# Altium schematic sheet pulse_gen.SchDoc: Pulse Generation
size A; Engineer: A. Peck; Organization: UCLA High Energy Physics; DocumentNumber: 11; Revision: 3.0; SheetNumber: 11; SheetTotal: 15; Project: LCT Comparator Tester
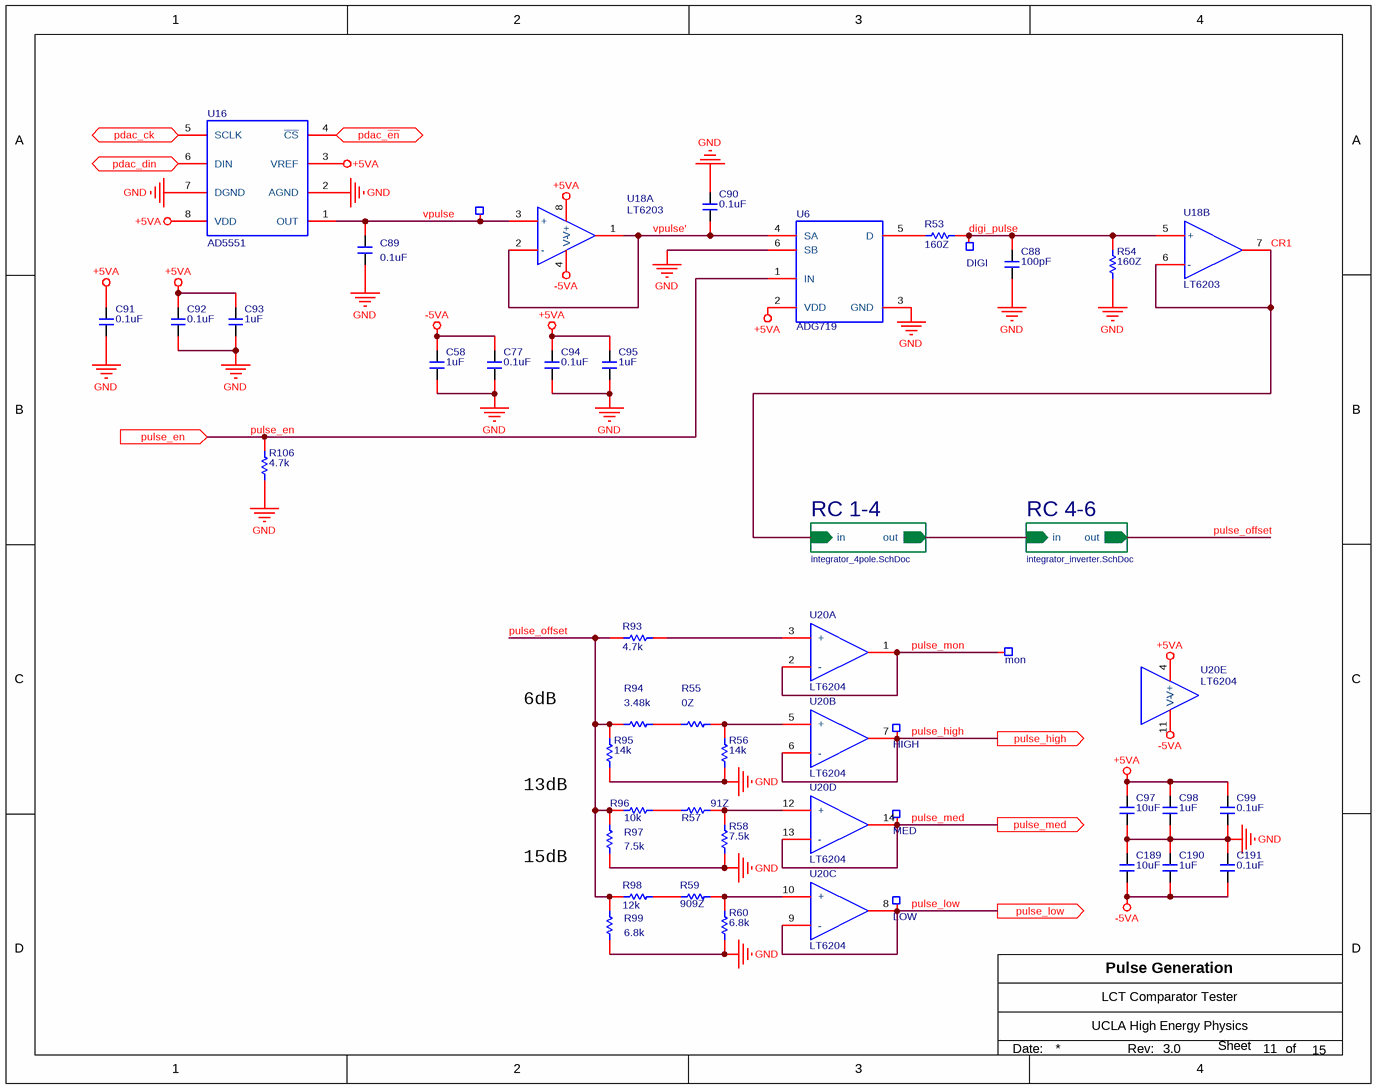
[diagram p0: pulse_gen.SchDoc]

## Parts
C58  1uF  [C0603]
C77  0.1uF  [C0603]
C88  100pF  [C0603]
C89  0.1uF  [C0603]
C90  0.1uF  [C0603]
C91  0.1uF  [C0603]
C92  0.1uF  [C0603]
C93  1uF  [C0603]
C94  0.1uF  [C0603]
C95  1uF  [C0603]
C97  10uF  [c1206]
C98  1uF  [C0603]
C99  0.1uF  [C0603]
C189  10uF  [c1206]
C190  1uF  [C0603]
C191  0.1uF  [C0603]
mon  TP_SMALL  [TP_SMALL]  (value not drawn)  (no BOM)
R53  160Z  [R0603]
R54  160Z  [R0603]
R55  0Z  [R0805]
R56  14k  [R0805]
R57  91Z  [R0805]
R58  7.5k  [R0805]
R59  909Z  [R0805]
R60  6.8k  [R0805]
R93  4.7k  [R0805]
R94  3.48k  [R0805]
R95  14k  [R0805]
R96  10k  [R0805]
R97  7.5k  [R0805]
R98  12k  [R0805]
R99  6.8k  [R0805]
R106  4.7k  [R0603]
TP27  PDAC  [TP_MICRO]  (value not drawn)  (no BOM)
TP28  DIGI  [TP_MICRO]  (no BOM)
TP29  HIGH  [TP_MICRO]  (no BOM)
TP30  MED  [TP_MICRO]  (no BOM)
TP31  LOW  [TP_MICRO]  (no BOM)
U6  ADG719  [SOT23-6]
U16  AD5551  [SOIC-8]
U18  LT6203  [SOIC-8]  (parts A,B of 2)
U20  LT6204  [SOIC-14]  (parts A,B,C,D,E of 5)

## Sub-sheets
RC 1-4 = integrator_4pole.SchDoc: out (out), in (in)
RC 4-6 = integrator_inverter.SchDoc: out (out), in (in)

## Ports
pdac_ck (in), pdac_din (in), pdac_~{en} (in), pulse_en (in), pulse_high (out), pulse_low (out), pulse_med (out)

## Nets
+5VA: C91.2 C92.2 C93.2 C94.2 C95.2 C97.1 C98.2 C99.2 U6.2(VDD) U16.3(VREF) U16.8(VDD) U18.8(V+) U20.4(V+)
-5VA: C58.2 C77.2 C189.2 C190.1 C191.1 U18.4(V-) U20.11(V-)
GND: C58.1 C77.1 C88.1 C89.1 C90.1 C91.1 C92.1 C93.1 C94.1 C95.1 C97.2 C98.1 C99.1 C189.1 C190.2 C191.2 R54.1 R56.1 R58.1 R60.1 R95.1 R97.1 R99.1 R106.1 U6.3(GND) U6.6(SB) U16.2(AGND) U16.7(DGND)
CR1: U18.6(-) U18.7(OUTB) ; sheet RC 1-4/in
digi_pulse: C88.2 R53.2 R54.2 TP28.1 U18.5(+)
pdac_ck: U16.5(SCLK) ; port pdac_ck
pdac_din: U16.6(DIN) ; port pdac_din
pdac_~{en}: U16.4(~{CS}) ; port pdac_~{en}
pulse_en: R106.2 U6.1(IN) ; port pulse_en
pulse_high: TP29.1 U20.6(-) U20.7(OUT) ; port pulse_high
pulse_low: TP31.1 U20.8(OUT) U20.9(-) ; port pulse_low
pulse_med: TP30.1 U20.13(-) U20.14(OUT) ; port pulse_med
pulse_mon: mon.1 U20.1(OUT) U20.2(-)
pulse_offset: R93.1 R94.1 R95.2 R96.1 R97.2 R98.1 R99.2 ; sheet RC 4-6/out
vpulse: C89.2 TP27.1 U16.1(OUT) U18.3(+)
vpulse': C90.2 U6.4(SA) U18.1(OUTA) U18.2(-)
NetR53_1: R53.1 U6.5(NC)
NetR55_1: R55.1 R94.2
NetR55_2: R55.2 R56.2 U20.5(+)
NetR57_1: R57.1 R96.2
NetR57_2: R57.2 R58.2 U20.12(+)
NetR59_1: R59.1 R60.2 U20.10(+)
NetR59_2: R59.2 R98.2
NetR93_2: R93.2 U20.3(+)
(unnamed): sheet RC 1-4/out, sheet RC 4-6/in

## Notes on the sheet
- 6dB
- 13dB
- 15dB
- Date:
- Rev:
- of
- Sheet

## Library data of the parts
C58 C93 C95 C98 C190 = Murata/GRM188R61E105KA12D: CAP-CER, 2, 1.0uF, 10%, 25V, 0603; Manufacturer: Murata Electronics North America; Capacitance: 1µF; Temperature Coefficient: X5R; Supplier 1: Digi-Key; Supplier Part Number 1: 490-3897-1-ND; Manufacturer Part Number: GRM188R61E105KA12D; RoHS: RoHS Compliant; Category: Capacitors; Stock 1: 1899119; Pricing 1: 1=0.1, 10=0.036, 50=0.0196, 100=0.0165, 250=0.01352, 500=0.01156, 1000=0.009 (USD); Packaging: Cut Tape (CT); Tolerance: ±10%; Voltage - Rated: 25V; Mounting Type: Surface Mount, MLCC; Operating Temperature: -55°C ~ 85°C; Applications: General Purpose; Ratings: -; Package / Case: 0603 (1608 Metric); Size / Dimension: 0.063" L x 0.031" W (1.60mm x 0.80mm); Height - Seated (Max): -; Thickness (Max): 0.035" (0.90mm); Lead Spacing: -; Features: -; Lead Style: -; ComponentLink1URL: http://www.murata.com/~/media/webrenewal/support/library/catalog/products/capacitor/mlcc/c02e.pdf; ComponentLink1Description: http://www.murata.com/~/media/webrenewal/support/library/catalog/products/capacitor/mlcc/c02e.pdf
C77 C89-C92 C94 C99 C191 = CAP/06035C104KAT2A: CAP-CER, 2, 0.1uF, 10%, 50V, 0603, X7R; Manufacturer: AVX Corporation; Capacitance: 0.10µF; Supplier 1: Digi-Key; Manufacturer Part Number: 06035C104KAT2A; RoHS: RoHS Compliant; Category: Capacitors; Stock 1: 4412408; Pricing 1: 1=0.1, 10=0.036, 25=0.0264, 50=0.0198, 100=0.0162, 250=0.01352, 500=0.01156, 1000=0.00908 (USD); Packaging: Cut Tape (CT); Tolerance: ±10%; Voltage - Rated: 50V; Temperature Coefficient: X7R; Mounting Type: Surface Mount, MLCC; Operating Temperature: -55°C ~ 125°C; Applications: General Purpose; Ratings: -; Package / Case: 0603 (1608 Metric); Size / Dimension: 0.063" L x 0.032" W (1.60mm x 0.81mm); Height - Seated (Max): -; Thickness (Max): 0.035" (0.90mm); Lead Spacing: -; Features: -; Lead Style: -; ComponentLink1URL: http://datasheets.avx.com/X7RDielectric.pdf; ComponentLink1Description: http://datasheets.avx.com/X7RDielectric.pdf; Supplier Part Number 1: 478-5052-1-ND; Supplier 2: Newark; Supplier Part Number 2: 54K2412
C88 = AVX/06035A101KAT2A: CAP-CER, 0, 100pF, 10%, 50V, 0603; Manufacturer: AVX Corporation; Temperature Coefficient: C0G, NP0; Supplier 1: Digi-Key; Supplier Part Number 1: 478-3717-1-ND; Manufacturer Part Number: 06035A101KAT2A; RoHS: RoHS Compliant; Category: Capacitors; Stock 1: 55355; Pricing 1: 1=0.16, 10=0.117, 25=0.0856, 50=0.0664, 100=0.0551, 250=0.04556, 500=0.03862, 1000=0.03197 (USD); Packaging: Cut Tape (CT); Part Status: Active; Capacitance: 100pF; Tolerance: ±10%; Voltage - Rated: 50V; Operating Temperature: -55°C ~ 125°C; Features: -; Ratings: -; Applications: General Purpose; Failure Rate: *; Mounting Type: Surface Mount, MLCC; Package / Case: 0603 (1608 Metric); Size / Dimension: 0.063" L x 0.032" W (1.60mm x 0.81mm); Height - Seated (Max): -; Thickness (Max): 0.035" (0.90mm); Lead Spacing: -; Lead Style: -; ComponentLink1URL: http://catalogs.avx.com/SurfaceMount.pdf; ComponentLink1Description: http://catalogs.avx.com/SurfaceMount.pdf
C97 C189 = CAP/GMK316F106ZL-T: CAP-CER, 2, 10uF, 10%, 35V, 1206; Manufacturer: Taiyo Yuden; Capacitance: 10µF; Tolerance: -20%, +80%; Temperature Coefficient: Y5V (F); Supplier 1: Digi-Key; Manufacturer Part Number: GMK316F106ZL-T; RoHS: RoHS Compliant; Category: Capacitors; Packaging: Cut Tape (CT); Voltage - Rated: 35V; Mounting Type: Surface Mount, MLCC; Operating Temperature: -30°C ~ 85°C; Package / Case: 1206 (3216 Metric); Size / Dimension: 0.126" L x 0.063" W (3.20mm x 1.60mm); Height - Seated (Max): -; Lead Spacing: -; Features: -; ComponentLink1URL: http://ds.yuden.co.jp/TYCOMPAS/ut/detail.do?productNo=GMK316F106ZL-T&fileName=GMK316F106ZL-T_SS&mode=specSheetDownload; ComponentLink1Description: http://ds.yuden.co.jp/TYCOMPAS/ut/detail.do?productNo=GMK316F106ZL-T&fileName=GMK316F106ZL-T_SS&mode=specSheetDownload; Supplier Part Number 1: 587-1352-1-ND; Stock 1: 249989; Pricing 1: 1=0.46, 10=0.345, 50=0.2012, 100=0.161, 250=0.115, 500=0.0782, 1000=0.06325 (USD); Applications: General Purpose; Ratings: -; Thickness (Max): 0.071" (1.80mm); Lead Style: -
mon = TP_SMALL: Test Point, Generic, 50MIL
R53 R54 = CRCW0603160RFKEA: RES0, SMD,  160Z, 1.0%, 1/10W, 0603; Manufacturer: Vishay Dale; Resistance (Ohms): 160; Tolerance: ±1%; Power (Watts): 0.1W, 1/10W; Temperature Coefficient: ±100ppm/°C; Supplier 1: Digi-Key; Manufacturer Part Number: CRCW0603160RFKEA; RoHS: RoHS Compliant; Category: Resistors; Stock 1: 48671; Pricing 1: 1=0.1, 10=0.03, 25=0.022, 50=0.0168, 100=0.0123, 250=0.0094, 500=0.00752, 1000=0.00554, 2500=0.00481 (USD); Packaging: Cut Tape (CT); Part Status: Active; Composition: Thick Film; Features: Automotive AEC-Q200; Operating Temperature: -55°C ~ 155°C; Package / Case: 0603 (1608 Metric); Supplier Device Package: 0603; Size / Dimension: 0.063" L x 0.033" W (1.60mm x 0.85mm); Height - Seated (Max): 0.020" (0.50mm); Number of Terminations: 2; Failure Rate: -; ComponentLink1URL: http://www.vishay.com/docs/20035/dcrcwe3.pdf; ComponentLink1Description: http://www.vishay.com/docs/20035/dcrcwe3.pdf; Supplier Part Number 1: 541-160HCT-ND
R55 = CRCW08050000Z0EA: RES0, SMD, 0.00Z, 0805; Manufacturer: Vishay Dale; Resistance (Ohms): 0.0; Tolerance: Jumper; Power (Watts): 0.125W, 1/8W; Supplier 1: Digi-Key; Manufacturer Part Number: CRCW08050000Z0EA; RoHS: RoHS Compliant; Category: Resistors; Stock 1: 1159983; Pricing 1: 1=0.1, 10=0.026, 25=0.0184, 50=0.014, 100=0.0104, 250=0.00792, 500=0.00634, 1000=0.00466, 2500=0.00405 (USD); Packaging: Cut Tape (CT); Part Status: Active; Composition: Thick Film; Features: Automotive AEC-Q200; Temperature Coefficient: -; Operating Temperature: -55°C ~ 155°C; Package / Case: 0805 (2012 Metric); Supplier Device Package: 0805; Size / Dimension: 0.079" L x 0.049" W (2.00mm x 1.25mm); Height - Seated (Max): 0.020" (0.50mm); Number of Terminations: 2; Failure Rate: -; ComponentLink1URL: http://www.vishay.com/docs/20035/dcrcwe3.pdf; ComponentLink1Description: http://www.vishay.com/docs/20035/dcrcwe3.pdf; Supplier Part Number 1: 541-0.0ACT-ND
R56 R95 = RC0805FR-0714KL: RES1, SMD, 14.0k, 1.0%, 1/8W, 0805; Manufacturer: Yageo; Tolerance: ±1%; Power (Watts): 0.125W, 1/8W; Temperature Coefficient: ±100ppm/°C; Supplier 1: Digi-Key; Manufacturer Part Number: RC0805FR-0714KL; RoHS: RoHS Compliant; Category: Resistors; Stock 1: 169694; Pricing 1: 1=0.1, 10=0.021, 25=0.0152, 100=0.0084, 250=0.00644, 500=0.00514, 1000=0.00379, 2500=0.00329 (USD); Packaging: Cut Tape (CT); Part Status: Active; Resistance (Ohms): 14k; Composition: Thick Film; Features: Moisture Resistant; Operating Temperature: -55°C ~ 155°C; Package / Case: 0805 (2012 Metric); Supplier Device Package: 0805; Size / Dimension: 0.079" L x 0.049" W (2.00mm x 1.25mm); Height - Seated (Max): 0.024" (0.60mm); Number of Terminations: 2; Failure Rate: -; ComponentLink1URL: http://www.yageo.com/NewPortal/yageodocoutput?fileName=/pdf/R-Chip/PYu-RC_Group_51_RoHS_L_4.pdf; ComponentLink1Description: http://www.yageo.com/NewPortal/yageodocoutput?fileName=/pdf/R-Chip/PYu-RC_Group_51_RoHS_L_4.pdf; Supplier Part Number 1: 311-14.0KCRCT-ND
R57 = ERJ-6ENF91R0V: RES0, SMD, 91Z, 1.0%, 1/8W, 0805; Manufacturer: Panasonic Electronic Components; Resistance (Ohms): 91; Tolerance: ±1%; Power (Watts): 0.125W, 1/8W; Temperature Coefficient: ±100ppm/°C; Supplier 1: Digi-Key; Manufacturer Part Number: ERJ-6ENF91R0V; RoHS: RoHS Compliant; Category: Resistors; Stock 1: 64099; Pricing 1: 1=0.1, 50=0.022, 100=0.0162, 250=0.01236, 500=0.0099, 1000=0.00729 (USD); Packaging: Cut Tape (CT); Part Status: Active; Composition: Thick Film; Features: Automotive AEC-Q200; Operating Temperature: -55°C ~ 155°C; Package / Case: 0805 (2012 Metric); Supplier Device Package: 0805; Size / Dimension: 0.079" L x 0.049" W (2.00mm x 1.25mm); Height - Seated (Max): 0.028" (0.70mm); Number of Terminations: 2; Failure Rate: -; ComponentLink1URL: http://industrial.panasonic.com/www-cgi/jvcr13pz.cgi?E+PZ+3+AOA0002+ERJ6ENF91R0V+7+WW; ComponentLink1Description: http://industrial.panasonic.com/www-cgi/jvcr13pz.cgi?E+PZ+3+AOA0002+ERJ6ENF91R0V+7+WW; Supplier Part Number 1: P91.0CCT-ND
R58 R97 = RC0805FR-077K5L: RES1, SMD, 7.5k, 1.0%, 1/8W, 0805; Manufacturer: Yageo; Tolerance: ±1%; Power (Watts): 0.125W, 1/8W; Temperature Coefficient: ±100ppm/°C; Supplier 1: Digi-Key; Manufacturer Part Number: RC0805FR-077K5L; RoHS: RoHS Compliant; Category: Resistors; Stock 1: 186916; Pricing 1: 1=0.1, 10=0.021, 25=0.0152, 100=0.0084, 250=0.00644, 500=0.00514, 1000=0.00379, 2500=0.00329 (USD); Packaging: Cut Tape (CT); Part Status: Active; Resistance (Ohms): 7.5k; Composition: Thick Film; Features: Moisture Resistant; Operating Temperature: -55°C ~ 155°C; Package / Case: 0805 (2012 Metric); Supplier Device Package: 0805; Size / Dimension: 0.079" L x 0.049" W (2.00mm x 1.25mm); Height - Seated (Max): 0.024" (0.60mm); Number of Terminations: 2; Failure Rate: -; ComponentLink1URL: http://www.yageo.com/NewPortal/yageodocoutput?fileName=/pdf/R-Chip/PYu-RC_Group_51_RoHS_L_4.pdf; ComponentLink1Description: http://www.yageo.com/NewPortal/yageodocoutput?fileName=/pdf/R-Chip/PYu-RC_Group_51_RoHS_L_4.pdf; Supplier Part Number 1: 311-7.50KCRCT-ND
R59 = RC0805FR-07909RL: RES0, SMD, 6.8k, 1.0%, 1/8W, 0805; Manufacturer: Yageo; Resistance (Ohms): 909; Tolerance: ±1%; Power (Watts): 0.125W, 1/8W; Temperature Coefficient: ±100ppm/°C; Supplier 1: Digi-Key; Manufacturer Part Number: RC0805FR-07909RL; RoHS: RoHS Compliant; Category: Resistors; Stock 1: 53236; Pricing 1: 1=0.1, 10=0.021, 25=0.0152, 100=0.0084, 250=0.00644, 500=0.00514, 1000=0.00379, 2500=0.00329 (USD); Packaging: Cut Tape (CT); Part Status: Active; Composition: Thick Film; Features: Moisture Resistant; Operating Temperature: -55°C ~ 155°C; Package / Case: 0805 (2012 Metric); Supplier Device Package: 0805; Size / Dimension: 0.079" L x 0.049" W (2.00mm x 1.25mm); Height - Seated (Max): 0.024" (0.60mm); Number of Terminations: 2; Failure Rate: -; ComponentLink1URL: http://www.yageo.com/NewPortal/yageodocoutput?fileName=/pdf/R-Chip/PYu-RC_Group_51_RoHS_L_4.pdf; ComponentLink1Description: http://www.yageo.com/NewPortal/yageodocoutput?fileName=/pdf/R-Chip/PYu-RC_Group_51_RoHS_L_4.pdf; Supplier Part Number 1: 311-909CRCT-ND
R60 R99 = RC0805FR-076K8L: RES1, SMD, 6.8k, 1.0%, 1/8W, 0805; Manufacturer: Yageo; Tolerance: ±1%; Power (Watts): 0.125W, 1/8W; Temperature Coefficient: ±100ppm/°C; Supplier 1: Digi-Key; Manufacturer Part Number: RC0805FR-076K8L; RoHS: RoHS Compliant; Category: Resistors; Stock 1: 249753; Pricing 1: 1=0.1, 10=0.021, 25=0.0152, 100=0.0084, 250=0.00644, 500=0.00514, 1000=0.00379, 2500=0.00329 (USD); Packaging: Cut Tape (CT); Part Status: Active; Resistance (Ohms): 6.8k; Composition: Thick Film; Features: Moisture Resistant; Operating Temperature: -55°C ~ 155°C; Package / Case: 0805 (2012 Metric); Supplier Device Package: 0805; Size / Dimension: 0.079" L x 0.049" W (2.00mm x 1.25mm); Height - Seated (Max): 0.024" (0.60mm); Number of Terminations: 2; Failure Rate: -; ComponentLink1URL: http://www.yageo.com/NewPortal/yageodocoutput?fileName=/pdf/R-Chip/PYu-RC_Group_51_RoHS_L_4.pdf; ComponentLink1Description: http://www.yageo.com/NewPortal/yageodocoutput?fileName=/pdf/R-Chip/PYu-RC_Group_51_RoHS_L_4.pdf; Supplier Part Number 1: 311-6.80KCRCT-ND
R93 = CRCW08054K70FKEA: RES1, SMD, 4.70k, 1.0%, 1/10W, 0805; Manufacturer: Vishay Dale; Tolerance: ±1%; Power (Watts): 0.125W, 1/8W; Temperature Coefficient: ±100ppm/°C; Supplier 1: Digi-Key; Manufacturer Part Number: CRCW08054K70FKEA; RoHS: RoHS Compliant; Category: Resistors; Stock 1: 53264; Pricing 1: 1=0.1, 10=0.04, 25=0.0288, 50=0.022, 100=0.0162, 250=0.01236, 500=0.0099, 1000=0.00729, 2500=0.00632 (USD); Packaging: Cut Tape (CT); Part Status: Active; Resistance (Ohms): 4.7k; Composition: Thick Film; Features: Automotive AEC-Q200; Operating Temperature: -55°C ~ 155°C; Package / Case: 0805 (2012 Metric); Supplier Device Package: 0805; Size / Dimension: 0.079" L x 0.049" W (2.00mm x 1.25mm); Height - Seated (Max): 0.020" (0.50mm); Number of Terminations: 2; Failure Rate: -; ComponentLink1URL: http://www.vishay.com/docs/20035/dcrcwe3.pdf; ComponentLink1Description: http://www.vishay.com/docs/20035/dcrcwe3.pdf; Supplier Part Number 1: 541-4.70KCCT-ND
R94 = RC0805FR-073K48L: RES1, SMD, 3.48k, 1.0%, 1/10W, 0805; Manufacturer: Yageo; Tolerance: ±1%; Power (Watts): 0.125W, 1/8W; Temperature Coefficient: ±100ppm/°C; Supplier 1: Digi-Key; Manufacturer Part Number: RC0805FR-073K48L; RoHS: RoHS Compliant; Category: Resistors; Stock 1: 122027; Pricing 1: 1=0.1, 10=0.021, 25=0.0152, 100=0.0084, 250=0.00644, 500=0.00514, 1000=0.00379, 2500=0.00329 (USD); Packaging: Cut Tape (CT); Part Status: Active; Resistance (Ohms): 3.48k; Composition: Thick Film; Features: Moisture Resistant; Operating Temperature: -55°C ~ 155°C; Package / Case: 0805 (2012 Metric); Supplier Device Package: 0805; Size / Dimension: 0.079" L x 0.049" W (2.00mm x 1.25mm); Height - Seated (Max): 0.024" (0.60mm); Number of Terminations: 2; Failure Rate: -; ComponentLink1URL: http://www.yageo.com/NewPortal/yageodocoutput?fileName=/pdf/R-Chip/PYu-RC_Group_51_RoHS_L_4.pdf; ComponentLink1Description: http://www.yageo.com/NewPortal/yageodocoutput?fileName=/pdf/R-Chip/PYu-RC_Group_51_RoHS_L_4.pdf; Supplier Part Number 1: 311-3.48KCRCT-ND
R96 = RC0805FR-0710KL: RES1, SMD, 10.0k, 1.0%, 1/8W, 0805; Manufacturer: Yageo; Tolerance: ±1%; Power (Watts): 0.125W, 1/8W; Temperature Coefficient: ±100ppm/°C; Supplier 1: Digi-Key; Manufacturer Part Number: RC0805FR-0710KL; RoHS: RoHS Compliant; Category: Resistors; Stock 1: 9171495; Pricing 1: 1=0.1, 10=0.021, 25=0.0152, 100=0.0084, 250=0.00644, 500=0.00514, 1000=0.00379, 2500=0.00329 (USD); Packaging: Cut Tape (CT); Part Status: Active; Resistance (Ohms): 10k; Composition: Thick Film; Features: Moisture Resistant; Operating Temperature: -55°C ~ 155°C; Package / Case: 0805 (2012 Metric); Supplier Device Package: 0805; Size / Dimension: 0.079" L x 0.049" W (2.00mm x 1.25mm); Height - Seated (Max): 0.024" (0.60mm); Number of Terminations: 2; Failure Rate: -; ComponentLink1URL: http://www.yageo.com/NewPortal/yageodocoutput?fileName=/pdf/R-Chip/PYu-RC_Group_51_RoHS_L_4.pdf; ComponentLink1Description: http://www.yageo.com/NewPortal/yageodocoutput?fileName=/pdf/R-Chip/PYu-RC_Group_51_RoHS_L_4.pdf; Supplier Part Number 1: 311-10.0KCRCT-ND
R98 = RC0805FR-0712KL: RES1, SMD, 12.0k, 1.0%, 1/8W, 0805; Manufacturer: Yageo; Tolerance: ±1%; Power (Watts): 0.125W, 1/8W; Temperature Coefficient: ±100ppm/°C; Supplier 1: Digi-Key; Manufacturer Part Number: RC0805FR-0712KL; RoHS: RoHS Compliant; Category: Resistors; Stock 1: 293503; Pricing 1: 1=0.1, 10=0.021, 25=0.0152, 100=0.0084, 250=0.00644, 500=0.00514, 1000=0.00379, 2500=0.00329 (USD); Packaging: Cut Tape (CT); Part Status: Active; Resistance (Ohms): 12k; Composition: Thick Film; Features: Moisture Resistant; Operating Temperature: -55°C ~ 155°C; Package / Case: 0805 (2012 Metric); Supplier Device Package: 0805; Size / Dimension: 0.079" L x 0.049" W (2.00mm x 1.25mm); Height - Seated (Max): 0.024" (0.60mm); Number of Terminations: 2; Failure Rate: -; ComponentLink1URL: http://www.yageo.com/NewPortal/yageodocoutput?fileName=/pdf/R-Chip/PYu-RC_Group_51_RoHS_L_4.pdf; ComponentLink1Description: http://www.yageo.com/NewPortal/yageodocoutput?fileName=/pdf/R-Chip/PYu-RC_Group_51_RoHS_L_4.pdf; Supplier Part Number 1: 311-12.0KCRCT-ND
R106 = CRCW06034K70FKEA: RES1, SMD, 4.70k, 1.0%, 1/10W, 0603; Manufacturer: Vishay Dale; Tolerance: ±1%; Power (Watts): 0.1W, 1/10W; Temperature Coefficient: ±100ppm/°C; Supplier 1: Digi-Key; Manufacturer Part Number: CRCW06034K70FKEA; RoHS: RoHS Compliant; Category: Resistors; Stock 1: 413202; Pricing 1: 1=0.1, 10=0.03, 25=0.022, 50=0.0168, 100=0.0123, 250=0.0094, 500=0.00752, 1000=0.00554, 2500=0.00481 (USD); Packaging: Cut Tape (CT); Part Status: Active; Resistance (Ohms): 4.7k; Composition: Thick Film; Features: Automotive AEC-Q200; Operating Temperature: -55°C ~ 155°C; Package / Case: 0603 (1608 Metric); Supplier Device Package: 0603; Size / Dimension: 0.063" L x 0.033" W (1.60mm x 0.85mm); Height - Seated (Max): 0.020" (0.50mm); Number of Terminations: 2; Failure Rate: -; ComponentLink1URL: http://www.vishay.com/docs/20035/dcrcwe3.pdf; ComponentLink1Description: http://www.vishay.com/docs/20035/dcrcwe3.pdf; Supplier Part Number 1: 541-4.70KHCT-ND
TP27-TP31 = TP_MICRO: Test Point, Round, Small
U6 = ADG719 SOT23-6: SWITCH, SPDT, 2:1, 4 Ohm; Manufacturer: Analog Devices Inc.; Manufacturer Part Number: ADG719BRTZ-500RL7; Number of Circuits: 1; On-State Resistance (Max): 4 Ohm; Voltage - Supply, Single (V+): 1.8 V ~ 5.5 V; Switch Time (Ton, Toff) (Max): 7ns, 3ns (Typ); -3db Bandwidth: 200MHz; Channel Capacitance (CS(off), CD(off)): 7pF; Current - Leakage (IS(off)) (Max): 250pA; Crosstalk: -82dB @ 1MHz; Supplier 1: Digi-Key; RoHS: RoHS Compliant; Category: Integrated Circuits (ICs); Stock 1: 984; Pricing 1: 1=2.95, 10=2.648, 100=2.1281 (USD); Packaging: Cut Tape (CT); Part Status: Active; Switch Circuit: SPDT; Multiplexer/Demultiplexer Circuit: 2:1; Channel-to-Channel Matching (&Delta;Ron): -; Voltage - Supply, Dual (V±): -; Charge Injection: -; Operating Temperature: -40°C ~ 125°C (TA); Package / Case: SOT-23-6; Supplier Device Package: SOT-23-6; ComponentLink1URL: http://www.analog.com/media/en/technical-documentation/data-sheets/ADG719.pdf; ComponentLink1Description: http://www.analog.com/media/en/technical-documentation/data-sheets/ADG719.pdf; Supplier Part Number 1: ADG719BRTZ-500RL7CT-ND
U16 = AD/AD5551 SOIC-8: DAC, 14-BIT, 1MSPS; Manufacturer: Analog Devices Inc.; Manufacturer Part Number: AD5551BRZ; Number of Bits: 14; Number of D/A Converters: 1; Settling Time: 1µs (Typ); Output Type: Voltage - Unbuffered; Differential Output: No; Data Interface: SPI; Reference Type: External; Voltage - Supply, Analog: 2.7 V ~ 5.5 V; INL/DNL (LSB): ±0.15, ±0.15; Architecture: R-2R; Supplier 1: Digi-Key; RoHS: RoHS Compliant; Category: Integrated Circuits (ICs); Packaging: Tube; Part Status: Active; Voltage - Supply, Digital: 2.7 V ~ 5.5 V; Operating Temperature: -40°C ~ 85°C; Package / Case: 8-SOIC (0.154", 3.90mm Width); Supplier Device Package: 8-SOIC; ComponentLink1URL: http://www.analog.com/media/en/technical-documentation/data-sheets/AD5551_5552.pdf; ComponentLink1Description: http://www.analog.com/media/en/technical-documentation/data-sheets/AD5551_5552.pdf; Stock 1: 625; Pricing 1: 1=16.85, 10=15.487, 100=13.0795, 500=11.63516, 1000=10.67225, 2500=10.27104, 5000=9.95007 (USD); Supplier Part Number 1: AD5551BRZ-ND
U18 = LT6203 SOIC-8: OPA, 100MHz, Dual, RRIO, Single-supply, Unity Stable; Supplier 1: Digi-Key; Supplier Part Number 1: LT6203CS8#PBF-ND
U20 = LT6204 SOIC-14: OPA, 100MHz, Quad, RRIO, Unity Stable; Supplier 1: Digi-Key; Supplier Part Number 1: LT6204CS#PBF-ND